# Altium schematic sheet CPU.SchDoc
size A4
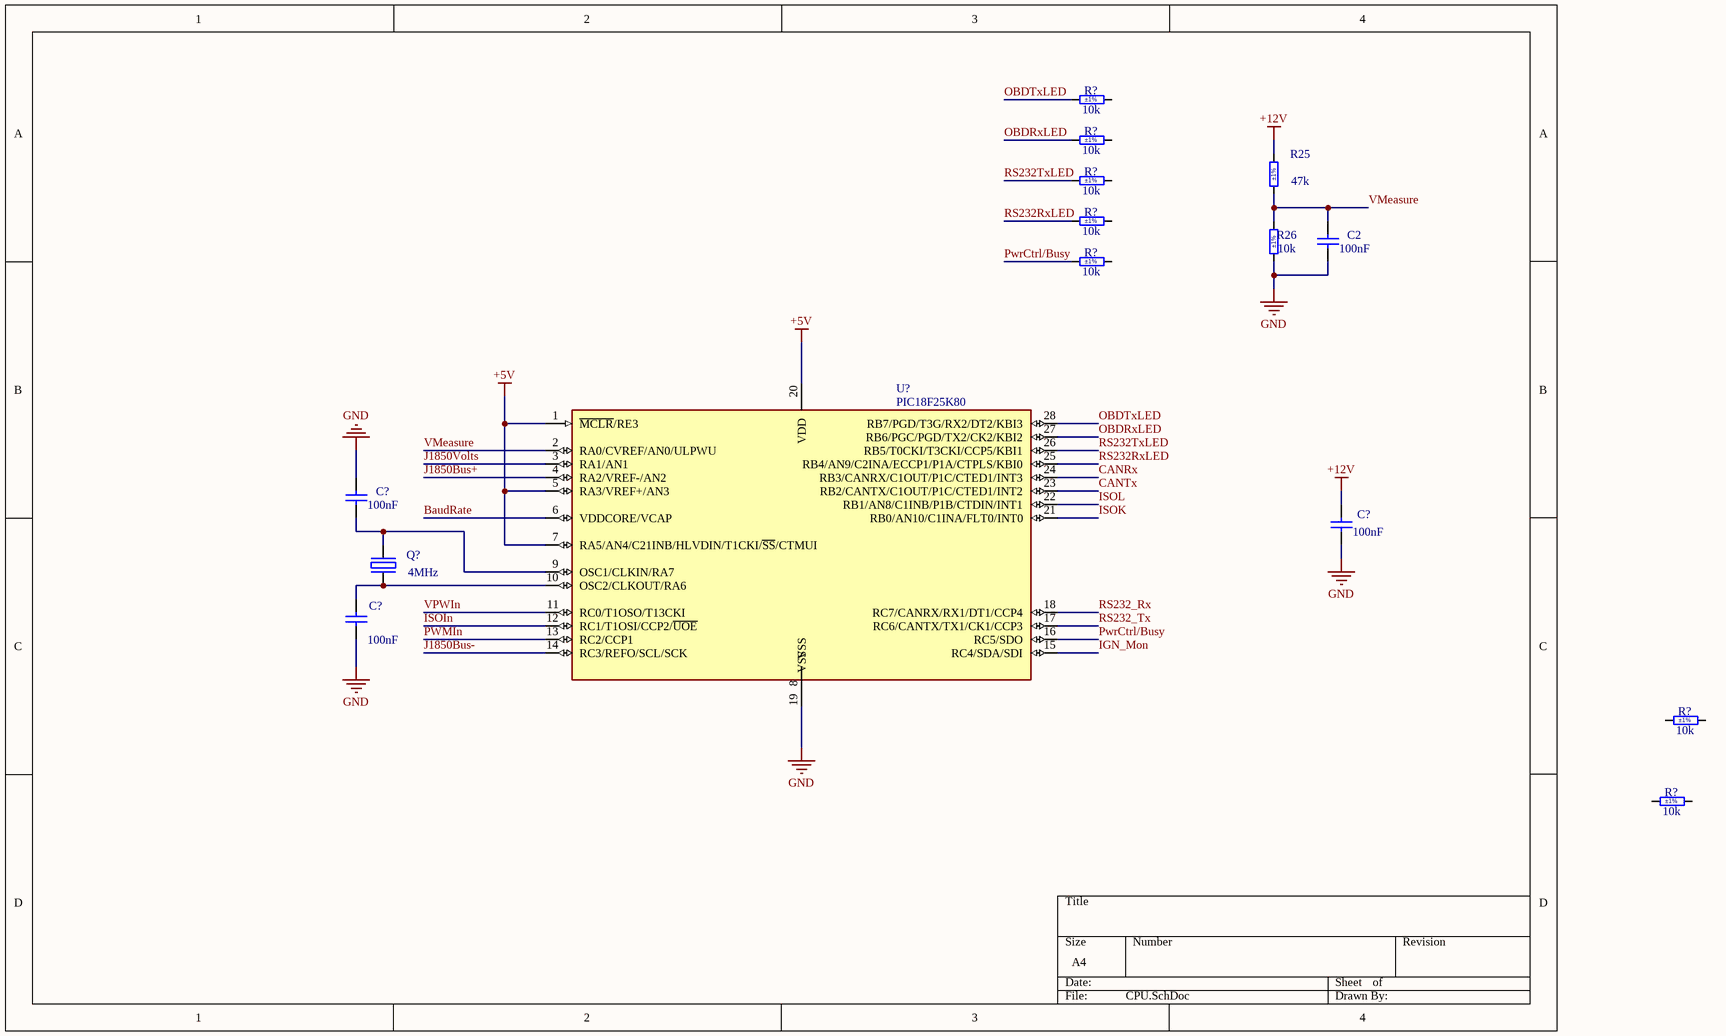
[diagram p0: CPU.SchDoc]

## Parts
(Parts that share a designator on the sheet are numbered #1, #2 ... from top to bottom, then left to right.)
C2  100nF  [CAPC2012X135N]
C?#1  100nF  [CAPC2012X135N]
C?#2  100nF  [CAPC2012X135N]
C?#3  100nF  [CAPC2012X135N]
Q?  4MHz  [XTAL1160X490X430]
R25  47k  Tolerance: ±1%  [RESC2012X60N]
R26  10k  Tolerance: ±1%  [RESC2012X60N]
R?#1  10k  Tolerance: ±1%  [RESC2012X60N]
R?#2  10k  Tolerance: ±1%  [RESC2012X60N]
R?#3  10k  Tolerance: ±1%  [RESC2012X60N]
R?#4  10k  Tolerance: ±1%  [RESC2012X60N]
R?#5  10k  Tolerance: ±1%  [RESC2012X60N]
R?#6  10k  Tolerance: ±1%  [RESC2012X60N]
R?#7  10k  Tolerance: ±1%  [RESC2012X60N]
U?  PIC18F25K80  [SOIC127P1032X265-28N]

## Nets
+5V: U?.1(~{MCLR}/RE3) U?.5(RA3/VREF+/AN3) U?.7(RA5/AN4/C21INB/HLVDIN/T1CKI/~{SS}/CTMUI) U?.20(VDD)
+12V: C?#2.2 R25.2
GND: C2.1 C?#1.2 C?#2.1 C?#3.1 R26.1 U?.19(VSS)
BaudRate: U?.6(VDDCORE/VCAP)
CANRx: U?.24(RB3/CANRX/C1OUT/P1C/CTED1/INT3)
CANTx: U?.23(RB2/CANTX/C1OUT/P1C/CTED1/INT2)
IGN_Mon: U?.15(RC4/SDA/SDI)
ISOIn: U?.12(RC1/T1OSI/CCP2/~{UOE})
ISOK: U?.21(RB0/AN10/C1INA/FLT0/INT0)
ISOL: U?.22(RB1/AN8/C1INB/P1B/CTDIN/INT1)
J1850Bus+: U?.4(RA2/VREF-/AN2)
J1850Bus-: U?.14(RC3/REFO/SCL/SCK)
J1850Volts: U?.3(RA1/AN1)
OBDRxLED: R?#2.1 U?.27(RB6/PGC/PGD/TX2/CK2/KBI2)
OBDTxLED: R?#1.1 U?.28(RB7/PGD/T3G/RX2/DT2/KBI3)
PWMIn: U?.13(RC2/CCP1)
PwrCtrl/Busy: R?#5.1 U?.16(RC5/SDO)
RS232_Rx: U?.18(RC7/CANRX/RX1/DT1/CCP4)
RS232_Tx: U?.17(RC6/CANTX/TX1/CK1/CCP3)
RS232RxLED: R?#4.1 U?.25(RB4/AN9/C2INA/ECCP1/P1A/CTPLS/KBI0)
RS232TxLED: R?#3.1 U?.26(RB5/T0CKI/T3CKI/CCP5/KBI1)
VMeasure: C2.2 R25.1 R26.2 U?.2(RA0/CVREF/AN0/ULPWU)
VPWIn: U?.11(RC0/T1OSO/T13CKI)
NetC?#1_1: C?#1.1 Q?.2(OSC2) U?.9(OSC1/CLKIN/RA7)
NetC?#3_2: C?#3.2 Q?.1(OSC1) U?.10(OSC2/CLKOUT/RA6)

Not connected (* = marked no-connect by the designer): R?#1 2; R?#2 2; R?#3 2; R?#4 2; R?#5 2; R?#6 1 2; R?#7 1 2; U? 8(VSS)

## Library data of the parts
C2 C?#1-C?#3 = CC0805_100NF_50V_10%_X7R: Non-polarised capacitor; Part Description: SMD Multilayer Chip Ceramic Capacitor; Manufacturer: GENERIC; Manufacturer1 Part Number: C2012X7R1H104K085; Voltage: 50V; TC: X7R; Tolerance: ±10%; Part Number: CC0805_100NF_50V_10%_X7R; Component Kind: Standard; Component Type: Standard; Pin Count: 2; Value: 100nF; Status: Preferred; Manufacturer Part Number: CC0805_100NF_50V_10%_X7R; Case: 0805; Mounted: Yes; Socket: No; SMD: Yes; Sense: No; Manufacturer1 Example: TDK; Manufacturer1 ComponentHeight: 1mm; HelpURL: \\cern.ch\dfs\Applications\Altium\Datasheets\CC0805_X7R_TDK_C.pdf; Author: CERN DEM JLC; CreateDate: 03.12.2007; LatestRevisionDate: 22.04.2015
Q? = XTAL_40MHZ_IQD_LFXTAL033584: Quartz Crystal; Part Description: Tolerance: ± 30ppm, Stability: ± 50ppm, -10°C to +66°C, 18pF, Surface Mount Quartz Crystal, HC49/4HSMX Series; Manufacturer: IQD FREQUENCY PRODUCTS; PressFit: No; Bonding: No; Part Number: XTAL_40MHZ_IQD_LFXTAL033584; Component Kind: Standard; Component Type: Standard; PackageDescription: HC-49/4HSMX Case, SMD Crystal; 2 Pins, Body 11.6mm L X 4.90mm W X 4.30mm H; Value: 4MHz; Manufacturer Part Number: LF XTAL033584; Pin Count: 2; Mounted: Yes; Socket: No; SMD: Yes; Sense: No; ComponentHeight: 4.3mm; HelpURL: \\cern.ch\dfs\Applications\Altium\Datasheets\XTAL_IQD_HC49-4HSMX.pdf; Author: CERN DEM JLC; CreateDate: 02.04.2012; LatestRevisionDate: 07.11.2016
R25 R26 R?#1-R?#7 = R0805_10K_1%_0.125W_100PPM: Resistor - 1%; Part Description: General Purpose Thick Film Chip Resistor; Manufacturer: GENERIC; Manufacturer1 Part Number: NRC10F1002TRF; Power: 0.125W; TC: ±100ppm/°C; PressFit: No; Part Number: R0805_10K_1%_0.125W_100PPM; Component Kind: Standard; Component Type: Standard; Pin Count: 2; Status: Preferred; Manufacturer Part Number: R0805_10K_1%_0.125W_100PPM; Case: 0805; Mounted: Yes; Sense: No; Socket: No; SMD: Yes; Manufacturer1 Example: NIC COMPONENT; Manufacturer1 ComponentHeight: 0.6mm; HelpURL: \\cern.ch\dfs\Applications\Altium\Datasheets\R0805_NIC_NRC.pdf; Author: CERN DEM JLC; CreateDate: 03.12.2007; LatestRevisionDate: 13.03.2008
  R25: Value: 47k
  R26 R?#1-R?#7: Value: 10k
U? = PIC18F25K80: PIC PICÂ® XLPâ„¢ 18K Microcontroller IC 8-Bit 64MHz 32KB (16K x 16) FLASH 28-QFN-S (6x6); MF: Microchip; SnapEDA_Link: https://www.snapeda.com/parts/PIC18F25K80/Microchip/view-part/?ref=snap; Package: QFN-28 Microchip; Value: *; MP: PIC18F25K80; Check_prices: https://www.snapeda.com/parts/PIC18F25K80/Microchip/view-part/?ref=eda